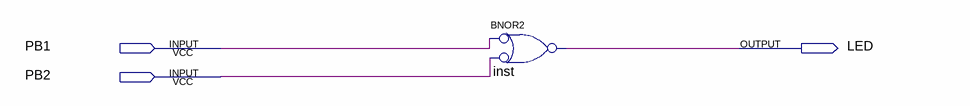
[diagram p0: schematic sheet]
// Quartus schematic orgate.bdf as structural Verilog: 1 symbols, 3 pins
module orgate (
  input  PB1,
  input  PB2,
  output LED
);

  nor inst (LED, ~PB1, ~PB2);  // BNOR2
endmodule
